# Altium schematic sheet Power.SchDoc
size A3; SheetNumber: 5; SheetTotal: 10
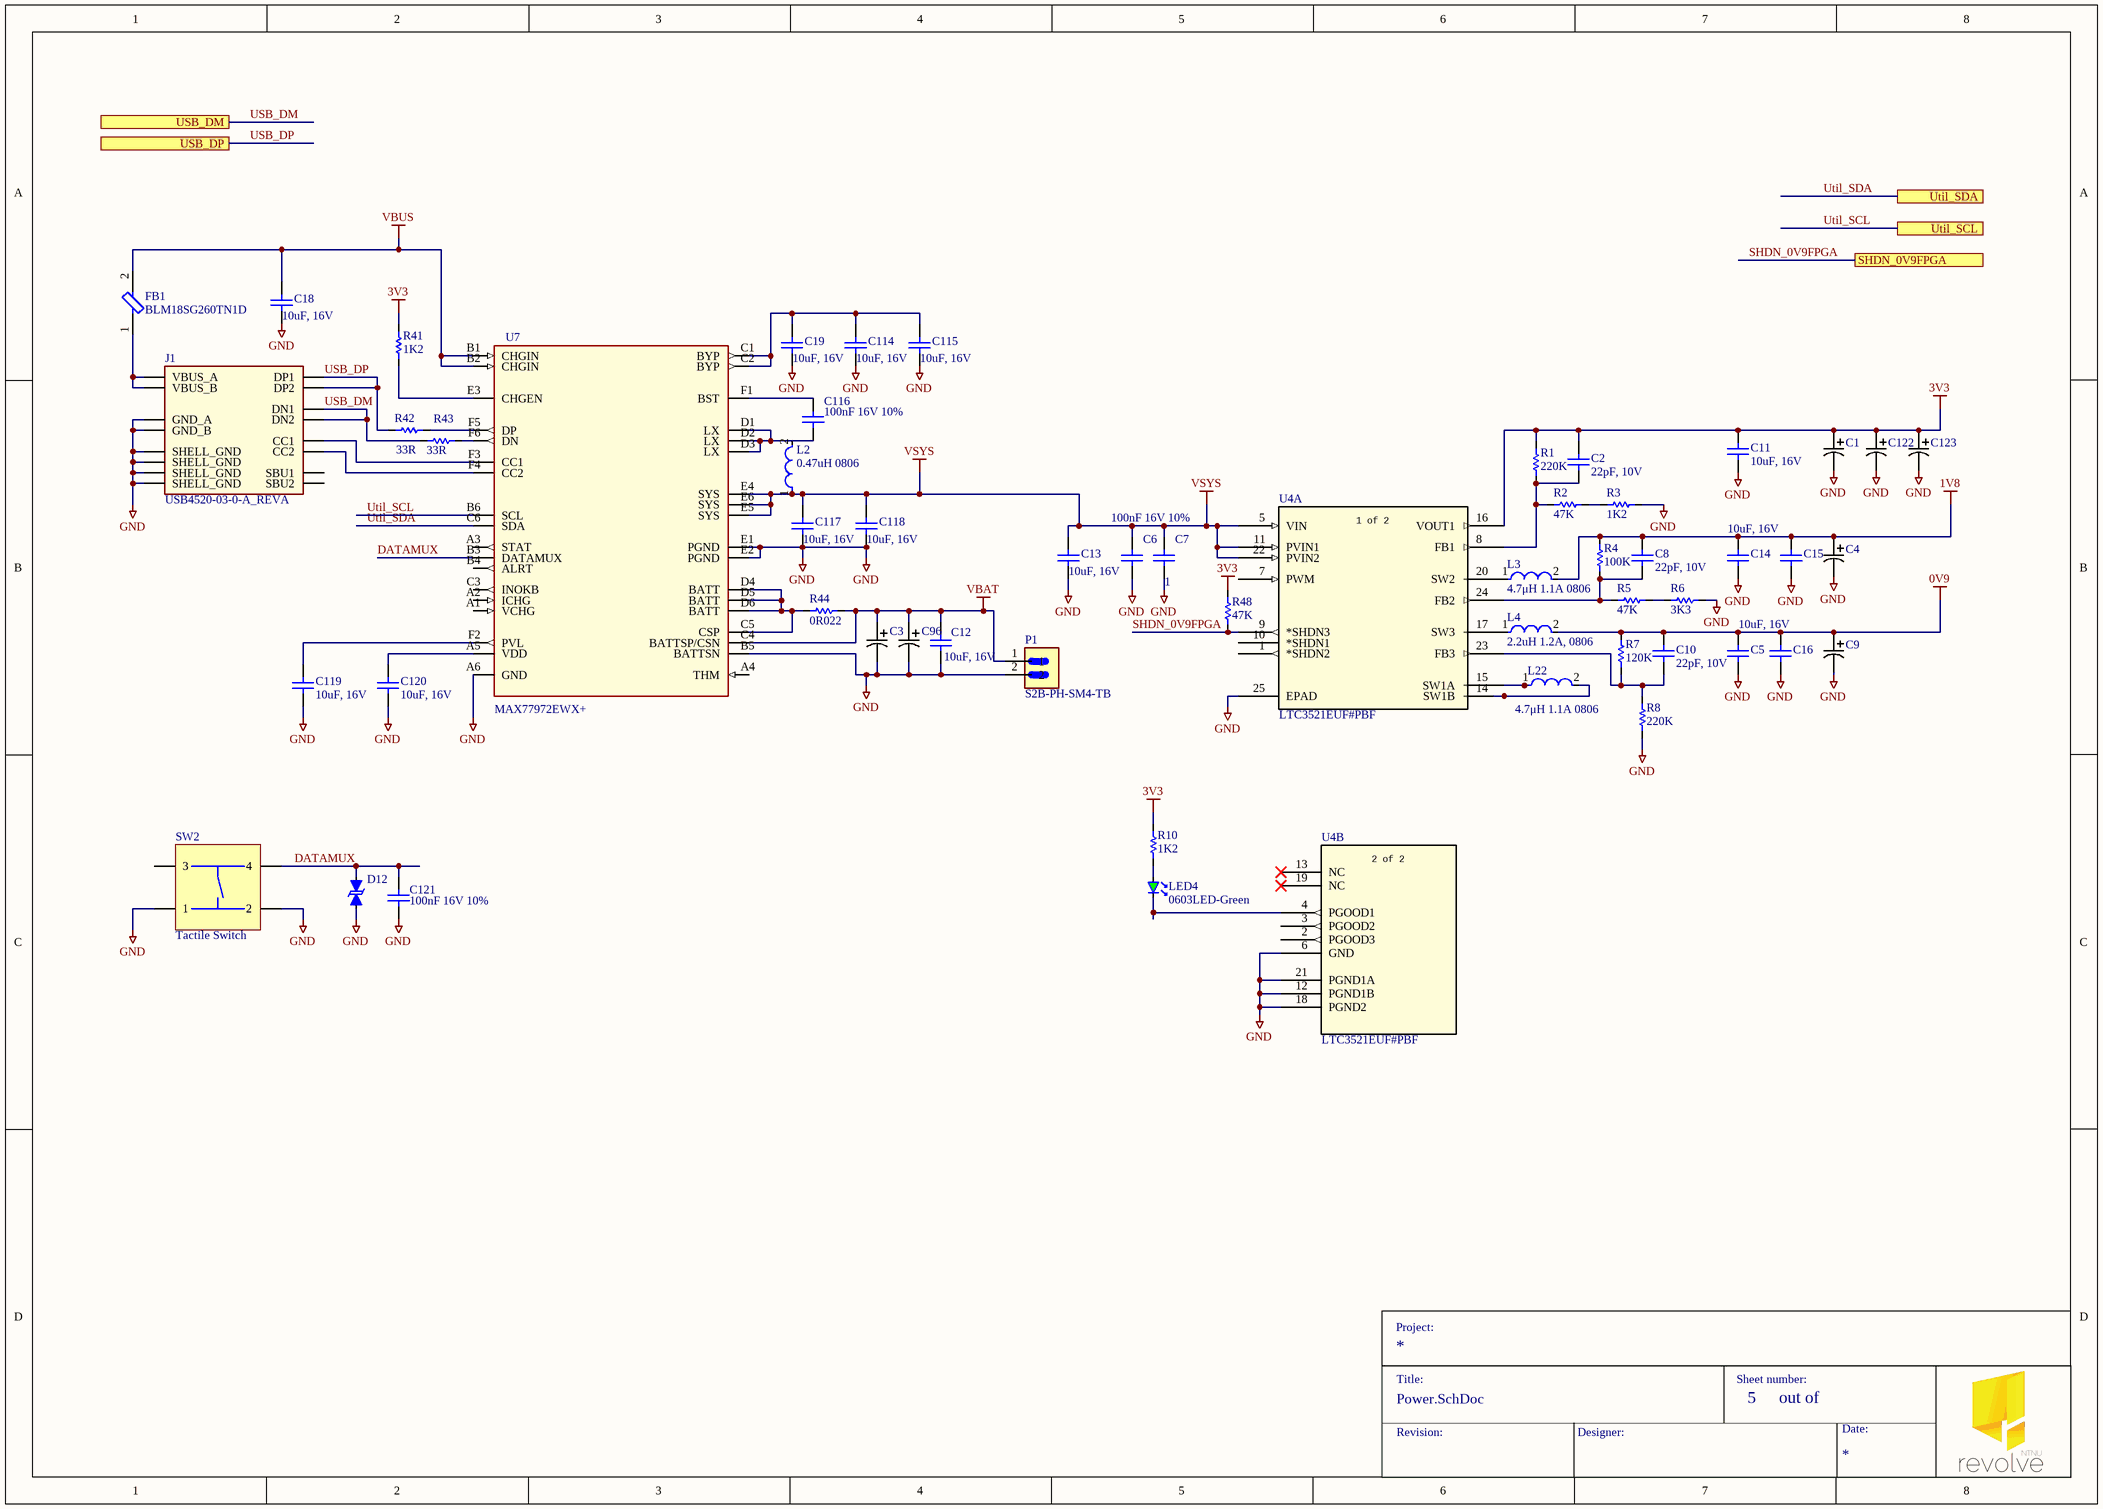
[diagram p0: Power.SchDoc]

## Parts
C1  T529P476M006AAE150  [CAPMP2.1X1.25_1N_KEM]  (value not drawn)
C2  22pF, 10V  [0603 Capacitor]
C3  T529P476M006AAE150  [CAPMP2.1X1.25_1N_KEM]  (value not drawn)
C4  T529P476M006AAE150  [CAPMP2.1X1.25_1N_KEM]  (value not drawn)
C5  10uF, 16V  [0603 Capacitor]
C6  100nF 16V 10%  [0402]
C7  1  [0402]
C8  22pF, 10V  [0603 Capacitor]
C9  T529P476M006AAE150  [CAPMP2.1X1.25_1N_KEM]  (value not drawn)
C10  22pF, 10V  [0603 Capacitor]
C11  10uF, 16V  [0603 Capacitor]
C12  10uF, 16V  [0603 Capacitor]
C13  10uF, 16V  [0603 Capacitor]
C14  10uF, 16V  [0603 Capacitor]
C15  10uF, 16V  [0603 Capacitor]  (value not drawn)
C16  10uF, 16V  [0603 Capacitor]  (value not drawn)
C18  10uF, 16V  [0603 Capacitor]
C19  10uF, 16V  [0603 Capacitor]
C96  T529P476M006AAE150  [CAPMP2.1X1.25_1N_KEM]  (value not drawn)
C114  10uF, 16V  [0603 Capacitor]
C115  10uF, 16V  [0603 Capacitor]
C116  100nF 16V 10%  [0402]
C117  10uF, 16V  [0603 Capacitor]
C118  10uF, 16V  [0603 Capacitor]
C119  10uF, 16V  [0603 Capacitor]
C120  10uF, 16V  [0603 Capacitor]
C121  100nF 16V 10%  [0402]
C122  T529P476M006AAE150  [CAPMP2.1X1.25_1N_KEM]  (value not drawn)
C123  T529P476M006AAE150  [CAPMP2.1X1.25_1N_KEM]  (value not drawn)
D12  DESD3V3E1BL-7B  [CR_X1-DFN1006-2_DIO-M]  (value not drawn)
FB1  BLM18SG260TN1D  [FP-BLM18-0_15-t0_5-d3_3-IPC_B]
J1  USB4520-03-0-A_REVA  [GCT_USB4520-03-0-A_REVA]
L2  0.47uH 0806  [FP-LQM2MPN_G0-IPC_B]
L3  4.7μH 1.1A 0806  [FP-LQM2MPN_G0-IPC_B]
L4  2.2uH 1.2A, 0806  [FP-LQM2MPN_G0-IPC_B]
L22  4.7μH 1.1A 0806  [FP-LQM2MPN_G0-IPC_B]
LED4  0603LED-Green  [LED-0603-RED]
P1  S2B-PH-SM4-TB  [JST_S2B-PH-SM4-TB]
R1  220K  [0603 Resistor]
R2  47K  [0603 Resistor]
R3  1K2  [0603 Resistor]
R4  100K  [0603 Resistor]
R5  47K  [0603 Resistor]
R6  3K3  [0603 Resistor]
R7  120K  [0603 Resistor]
R8  220K  [0603 Resistor]
R10  1K2  [0603 Resistor]
R41  1K2  [0603 Resistor]
R42  33R  [0603 Resistor]
R43  33R  [0603 Resistor]
R44  0R022  [1206 Resistor Package]
R48  47K  [0603 Resistor]
SW2  Tactile Switch  [TE connectivity part no. 2-1437565-8]
U4  LTC3521EUF#PBF  [QFN-24_UF_LIT-M]  (parts A,B of 2)
U7  MAX77972EWX+  [21-100517_W363B3+1_ADI]

## Ports
SHDN_0V9FPGA, USB_DM, USB_DP, Util_SCL, Util_SDA

## Nets
0V9: C5.2 C9.1 C10.2 C16.2 L4.2 R7.2
1V8: C4.1 C8.2 C14.2 C15.2 L3.2 R4.2
3V3: C1.1 C2.2 C11.2 C122.1 C123.1 R1.2 R10.2 R41.2 R48.2 U4.16(VOUT1)
GND: C1.2 C3.2 C4.2 C5.1 C6.1 C7.1 C9.2 C11.1 C12.1 C13.1 C14.1 C15.1 C16.1 C18.1 C19.1 C96.2 C114.1 C115.1 C117.1 C118.1 C119.1 C120.1 C121.1 C122.2 C123.2 D12.2(ANODE) J1.A1_B12(GND_A) J1.B1_A12(GND_B) J1.S1(SHELL_GND) J1.S2(SHELL_GND) J1.S3(SHELL_GND) J1.S4(SHELL_GND) P1.2 R3.2 R6.2 R8.1 SW2.1 SW2.2 U4.6(GND) U4.12(PGND1B) U4.18(PGND2) U4.21(PGND1A) U4.25(EPAD) U7.A6(GND) U7.B5(BATTSN) U7.E1(PGND) U7.E2(PGND)
VBAT: C3.1 C12.2 C96.1 P1.1 R44.2 U7.C4(BATTSP/CSN)
VBUS: C18.2 FB1.2 U7.B1(CHGIN) U7.B2(CHGIN)
VSYS: C6.2 C7.2 C13.2 C117.2 C118.2 L2.1 U4.5(VIN) U4.11(PVIN1) U4.22(PVIN2) U7.E4(SYS) U7.E5(SYS) U7.E6(SYS)
DATAMUX: C121.2 D12.1(CATHODE) SW2.4 U7.B3(DATAMUX)
SHDN_0V9FPGA: R48.1 U4.9(*SHDN3) ; port SHDN_0V9FPGA
USB_DM: J1.A7(DN1) J1.B7(DN2) R43.1 ; port USB_DM
USB_DP: J1.A6(DP1) J1.B6(DP2) R42.1 ; port USB_DP
Util_SCL: U7.B6(SCL) ; port Util_SCL
Util_SDA: U7.C6(SDA) ; port Util_SDA
NetC2_1: C2.1 R1.1 R2.2 U4.8(FB1)
NetC8_1: C8.1 R4.1 R5.1 U4.24(FB2)
NetC10_1: C10.1 R7.1 R8.2 U4.23(FB3)
NetC19_2: C19.2 C114.2 C115.2 U7.C1(BYP) U7.C2(BYP)
NetC116_1: C116.1 U7.D1(LX) U7.D2(LX) U7.D3(LX)
NetC116_2: C116.2 U7.F1(BST)
NetC119_2: C119.2 U7.F2(PVL)
NetC120_2: C120.2 U7.A5(VDD)
NetFB1_1: FB1.1 J1.A4_B9(VBUS_A) J1.B4_A9(VBUS_B)
NetJ1_A5: J1.A5(CC1) U7.F3(CC1)
NetJ1_B5: J1.B5(CC2) U7.F4(CC2)
NetL3_1: L3.1 U4.20(SW2)
NetL4_1: L4.1 U4.17(SW3)
NetL22_1: L22.1 U4.15(SW1A)
NetLED4_1: LED4.1(A) R10.1
NetLED4_2: LED4.2(K) U4.4(PGOOD1)
NetR2_1: R2.1 R3.1
NetR5_2: R5.2 R6.1
NetR41_1: R41.1 U7.E3(CHGEN)
NetR42_2: R42.2 U7.F5(DP)
NetR43_2: R43.2 U7.F6(DN)
NetR44_1: R44.1 U7.C5(CSP) U7.D4(BATT) U7.D5(BATT) U7.D6(BATT)

Not connected (* = marked no-connect by the designer): J1 A8(SBU1) B8(SBU2); L2 2; L22 2; SW2 3; U4 1(*SHDN2) 2(PGOOD3) 3(PGOOD2) 7(PWM) 10(*SHDN1) 13(NC)* 14(SW1B) 19(NC)*; U7 A1(VCHG) A2(ICHG) A3(STAT) A4(THM) B4(ALRT) C3(INOKB)

## Notes on the sheet
- Project:
- Title:
- Sheet number:
- Revision:
- Designer:
- out of
- Date:
- (in symbol LTC3521EUFPBF, part A) 1 of 2
- (in symbol LTC3521EUFPBF, part B) 2 of 2

## Library data of the parts
C1 C3 C4 C9 C96 C122 C123 = CAP-47uF-6.3V 0805: T529, Tantalum, Polymer Tantalum, Reduced Volume, 47 uF, 20%, 6.3 VDC, SMD, Polymer, Substrate, 150 mOhms, 2012, Height Max = 1mm; Manufacturer_Name: Kemet; Copyright: Copyright (C) 2025 Ultra Librarian. All rights reserved.; Manufacturer_Part_Number: T529P476M006AAE150; Datasheet: https://content.kemet.com/datasheets/KEM_T2076_T52X-530.pdf
C2 C8 C10 = CMP-001-C31-8: 22pF, 10V, 1%, NP0, 0603
C5 C11-C16 C18 C19 C114 C115 C117-C120 = CMP-001-B36-7: 10uF, 16V, 20%, X5R, 0603; value: 10uF
C6 C7 C116 C121 = CMP-00017-A.2: 100nF 16V
D12 = DESD3V3E1BL-7B: TVS DIODE 3.3V, DFN1006-2, 13pF @ 1MHz; Manufacturer_Name: Diodes Inc; Copyright: Copyright (C) 2025 Ultra Librarian. All rights reserved.; Manufacturer_Part_Number: DESD3V3E1BL-7B; RefDes: RefDes; Type: Type
FB1 = CMP-001-N50.0.3: Ferrite Bead, 26 Ohm @ 100 MHz, 6A, 7mOhm; Min Frequency: 100MHz; Output Impedance: 26R; Filter Type: FERRITE CHIP; DC Resistance-Max: 7mR; Number of Functions: 1; Packaging: Tape and Reel; JESD-609 Code: e3; Min Operating Temperature: -55°C; Mount: Surface Mount; Case Code: 0603; Material: Ferrite; RoHS Compliant: Yes; Current Rating: 6A; Max Operating Temperature: 125°C; Terminal Finish: Tin; Construction: Chip Bead; Length: 1.6mm; Max Frequency: 100MHz; Height: 0.5mm; REACH SVHC: Yes; Width: 0.8mm
J1 = USB-C: USB Type C Receptacle for USB 2.0, SMT Type Mid Mount, 2.0mm Offset; MF: Global Connector Technology; Design Item ID: USB4520-03-0-A_REVA; Check_prices: https://www.snapeda.com/parts/USB4520-03-0-A/Global+Connector+Technology/view-part/?ref=eda; Value: *; Availability: In Stock; Source: USB4520-03-0-A_REVA.SchLib; Pin Count: 16; SnapEDA_Link: https://www.snapeda.com/parts/USB4520-03-0-A/Global+Connector+Technology/view-part/?ref=snap; Purchase-URL: https://pricing.snapeda.com/search/part/USB4520-03-0-A/?ref=eda; MP: USB4520-03-0-A; Package: None; Price: None; Component Type: Standard; Supplier 1: DigiKey; Supplier Part Number 1: 2073-USB4520-03-0-ACT-ND
L2 = Inductor SMD 0.47uH: Multilayer Type Inductor for Power Lines, 0806 (2016), 0.47μH, 30%, 0.022Ω, 4.8A, CIGT201610EHR47MNE; DC Resistance (DCR): 175mR; Max DC Current: 1.1A; Self Resonant Frequency: 20MHz; Inductance: 4.7uH; Test Frequency: 1MHz; Core Material: Ferrite; Shielding: Shielded; Case Code (Metric): 2016; Min Operating Temperature: -40°C; Width: 1.6mm; Depth: 1.6mm; Inductance Tolerance: 30%; Max Operating Temperature: 125°C; Length: 2mm; Case Code (Imperial): 0806; Case/Package: 0806; Tolerance: 30%; Military Standard: Not; Current Rating: 1.1A; Packaging: Tape and Reel; Package Quantity: 1; Lead Free: Lead Free; Termination: SMD/SMT; Height - Seated (Max): 0.039inch; REACH SVHC: No SVHC; Mount: Surface Mount; DC Current: 1.1A; Height: 0.9mm; Supplier 1: DigiKey; Supplier Part Number 1: 1276-6902-1-ND
L3 L22 = Inductor SMD 4.7uH 1.1A: Multilayer Type Inductor for Power Lines, 0806 (2016), 4.7μH, 30%, 0.175Ω, 1.1A, LQM2MPN4R7NG0L; DC Resistance (DCR): 175mR; Self Resonant Frequency: 20MHz; Inductance: 4.7uH; Test Frequency: 1MHz; Core Material: Ferrite; Shielding: Shielded; Case Code (Metric): 2016; Min Operating Temperature: -40°C; Width: 1.6mm; Depth: 1.6mm; Max DC Current: 1.1A; Inductance Tolerance: 30%; Max Operating Temperature: 125°C; Length: 2mm; Case Code (Imperial): 0806; Case/Package: 0806; Tolerance: 30%; Military Standard: Not; Current Rating: 1.1A; Packaging: Tape and Reel; Package Quantity: 1; Lead Free: Lead Free; Termination: SMD/SMT; Height - Seated (Max): 0.039inch; REACH SVHC: No SVHC; Mount: Surface Mount; DC Current: 1.1A; Height: 0.9mm; Supplier 1: Newark; Supplier Part Number 1: LQM2MPN4R7NG0L
L4 = Inductor SMD 2.2uH 1.2A: Multilayer Type Inductor for Power Lines, 0806 (2016), 4.7μH, 30%, 0.175Ω, 1.1A, LQM2MPN2R2NG0L; DC Resistance (DCR): 175mR; Self Resonant Frequency: 20MHz; Inductance: 4.7uH; Test Frequency: 1MHz; Core Material: Ferrite; Shielding: Shielded; Case Code (Metric): 2016; Min Operating Temperature: -40°C; Width: 1.6mm; Depth: 1.6mm; Max DC Current: 1.1A; Inductance Tolerance: 30%; Max Operating Temperature: 125°C; Length: 2mm; Case Code (Imperial): 0806; Case/Package: 0806; Tolerance: 30%; Military Standard: Not; Current Rating: 1.1A; Packaging: Tape and Reel; Package Quantity: 1; Lead Free: Lead Free; Termination: SMD/SMT; Height - Seated (Max): 0.039inch; REACH SVHC: No SVHC; Mount: Surface Mount; DC Current: 1.1A; Height: 0.9mm; Supplier 1: Avnet; Supplier Part Number 1: LQM2MPN2R2NG0L
LED4 = CMP-001-C10-9: SMD LED 0603, Green
P1 = CMP-005-000000-1: Connector Header Surface Mount, Right Angle 2 position 0.079 (2.00mm); MF: JST Sales; SnapEDA_Link: https://www.snapeda.com/parts/S2B-PH-SM4-TB/JST/view-part/?ref=snap; Package: None; Source: Handheld.SchLib; Value: *; Design Item ID: S2B-PH-SM4-TB; MP: S2B-PH-SM4-TB; Check_prices: https://www.snapeda.com/parts/S2B-PH-SM4-TB/JST/view-part/?ref=eda
R1 R8 = CMP-001-O90-1: 220K, 1%, 1/10W, 0603
R2 R5 R48 = CMP-001-B87-6: 47K, 1%, 1/10W, 0603
R3 R10 R41 = CMP-001-B03-6: 1K2, 5%, 1/10W, 0603
R4 = CMP-001-B15-7: 100K, 1%, 1/10W, 0603; Manufacturer Part Number: ERJ-3EKF1003V; Manufacturer: Panasonic; Resistance: 100kR; Temperature Coefficient: 100ppm/°C; Voltage Rating: 75V; Power Rating: 100mW; Packaging: Tape and Reel; Contact Plating: Tin; Supplier: Digi-Key; Tolerance: 1%; Package Quantity: 1; Length: 1.6mm; Weight: 7.1E-05oz; Number of Terminations: 2; Height: 0.022inch; Case/Package: 0603; Military Standard: Not; Depth: 0.8mm; REACH SVHC: No SVHC; Case Code (Metric): 1608; Min Operating Temperature: -55°C; Features: Automotive AEC-Q200; Max Operating Temperature: 155°C; Mount: Surface Mount; Voltage Rating (DC): 75V; Termination: SMD/SMT; Lead Free: Lead Free; Width: 0.8mm; Composition: Thick Film; Case Code (Imperial): 0603; Supplier Part Number: P100KHTR-ND; Max Power Dissipation: 100mW; Number of Pins: 2; Radiation Hardening: No
R6 = CMP-001-G92-A.2: 3K3, 5%, 1/10W, 0603
R7 = CMP-001-G12-A.2: 120K, 0.1%, 1/10W, 0603
R42 R43 = CMP-001-C30-7: 33R, 1%, 1/10W, 0603; Manufacturer: Panasonic; Manufacturer Part Number: ERJ-3EKF33R0V; Temperature Coefficient: 100ppm/°C; Max Power Dissipation: 100mW; Voltage Rating: 75V; REACH SVHC: No SVHC; Resistance: 33R; Composition: Thick Film; Tolerance: 1%; Lead Free: Lead Free; Contact Plating: Tin; Package Quantity: 1; Number of Terminations: 2; Number of Pins: 2; Case Code (Metric): 1608; Width: 0.031inch; Min Operating Temperature: -55°C; Military Standard: Not; Termination: SMD/SMT; Radiation Hardening: No; Case Code (Imperial): 0603; Mount: Surface Mount; Depth: 0.8mm; Max Operating Temperature: 155°C; Voltage Rating (DC): 75V; Features: Automotive AEC-Q200; Power Rating: 100mW; Packaging: Tape and Reel; Supplier Part Number: P33.0HCT-ND; Length: 1.6mm; Supplier: Digi-Key; Height: 0.022inch; Case/Package: 0603
R44 = CMP-001-H36-A.1: 0R022, 2%, 1/2W, 1206
SW2 = CMP-001-E74-6: Tactile Switch, 24V, 50 mA, Pushbutton - N.O, 2-1437565-8
U4 = LTC3521EUFPBF: 1A Buck-Boost DC/DC and Dual 600mA Buck DC/DC Converters; Manufacturer_Name: Analog Devices Inc; Copyright: Copyright (C) 2025 Ultra Librarian. All rights reserved.; Manufacturer_Part_Number: LTC3521EUF#PBF; Datasheet: https://www.analog.com/media/en/technical-documentation/data-sheets/3521fb.pdf; RefDes: RefDes; Type: Type
U7 = MAX77972EWX+: AccuCharge + ModelGauge 1-Cell Fuel Gauge and 3A Charger with Integrated USB Type-C Detection; Manufacturer_Name: Analog Devices Inc; Copyright: Copyright (C) 2025 Ultra Librarian. All rights reserved.; Manufacturer_Part_Number: MAX77972EWX+; RefDes: RefDes; Type: Type